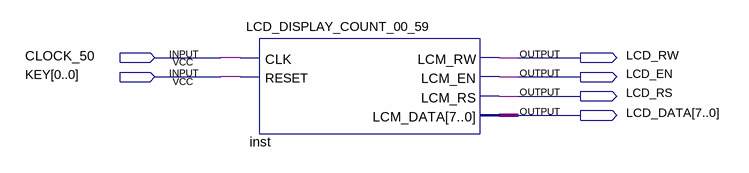
[diagram p0: schematic sheet]
// Quartus schematic lcd_59.bdf as structural Verilog: 1 symbols, 6 pins
module lcd_59 (
  input  CLOCK_50,
  input  [0:0] KEY,
  output LCD_RW,
  output LCD_EN,
  output LCD_RS,
  output [7:0] LCD_DATA
);

  LCD_DISPLAY_COUNT_00_59 inst (
    .CLK(CLOCK_50), .RESET(KEY[0]), .LCM_RW(LCD_RW), .LCM_EN(LCD_EN), .LCM_RS(LCD_RS), .LCM_DATA(LCD_DATA));
endmodule
